# EAGLE design untitled (EAGLE 9.6.2)
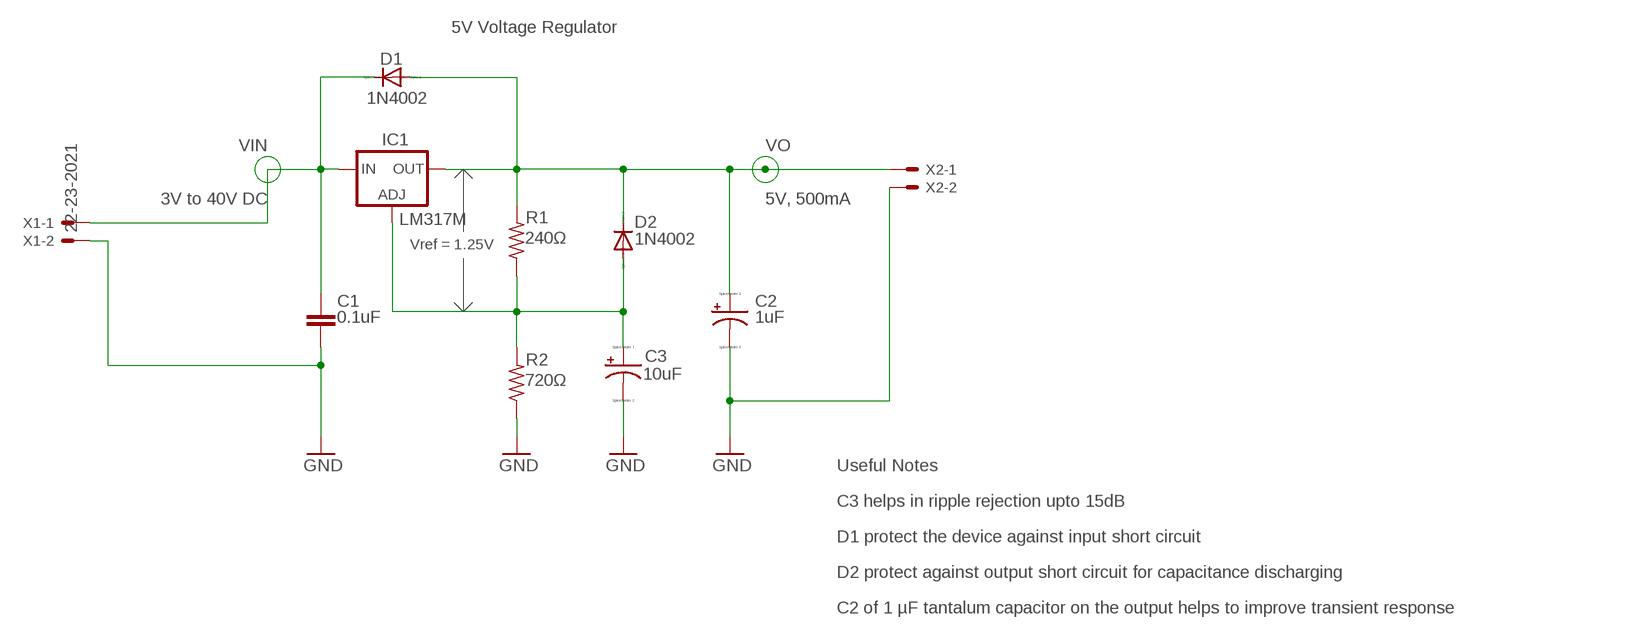
[diagram p0: schematic, sheet 1]

## Parts
C1  0.1uF  C-EU075-052X106  [C075-052X106]
C2  1uF  CPOL-US085CS-1AR  [085CS_1AR]
C3  10uF  CPOL-US085CS-1AR  [085CS_1AR]
D1  1N4002  1N4004  [DO41-10]
D2  1N4002  1N4004  [DO41-10]
IC1  LM317MBSTT3  [SOT223]
R1  240Ω  R-US_M0805  [M0805]
R2  720Ω  R-US_M0805  [M0805]
X1  22-23-2021  [22-23-2021]
X2  22-23-2021  [22-23-2021]

## Nets
GND: C1.2 C2.- C3.- R2.1 X1.2 X2.2
N$1: C3.+ D2.A IC1.1(ADJ) R1.1 R2.2
VIN: C1.1 D1.C IC1.3(IN) X1.1
VO: C2.+ D1.A D2.C IC1.4(OUT) R1.2 X2.1

## Notes on the sheet
- 5V Voltage Regulator
- 3V to 40V DC | 5V, 500mA
- Vref = 1.25V
- Useful Notes
- C3 helps in ripple rejection upto 15dB
- D1 protect the device against input short circuit
- D2 protect against output short circuit for capacitance discharging
- C2 of 1 µF tantalum capacitor on the output helps to improve transient response

## Library data of the parts
C1 = rcl:C-EU: CAPACITOR, European symbol
C2 C3 = resistor:CPOL-US: POLARIZED CAPACITOR, American symbol
D1 D2 = diode:1N4004: DIODE general purpose rectifier, 1 A
IC1 = v-reg:LM317?*: 500 mA Adjustable Output Positive Voltage Regulator Source: http://www.onsemi.co.jp .. LM317M-D.PDF; PARTNUMBER: LM317M
R1 R2 = resistor:R-US_: RESISTOR, American symbol
X1 X2 = con-molex:22-23-2021: .100" (2.54mm) Center Header - 2 Pin; MF: MOLEX; MPN: 22-23-2021; OC_FARNELL: 1462926; OC_NEWARK: 25C3832

## Board
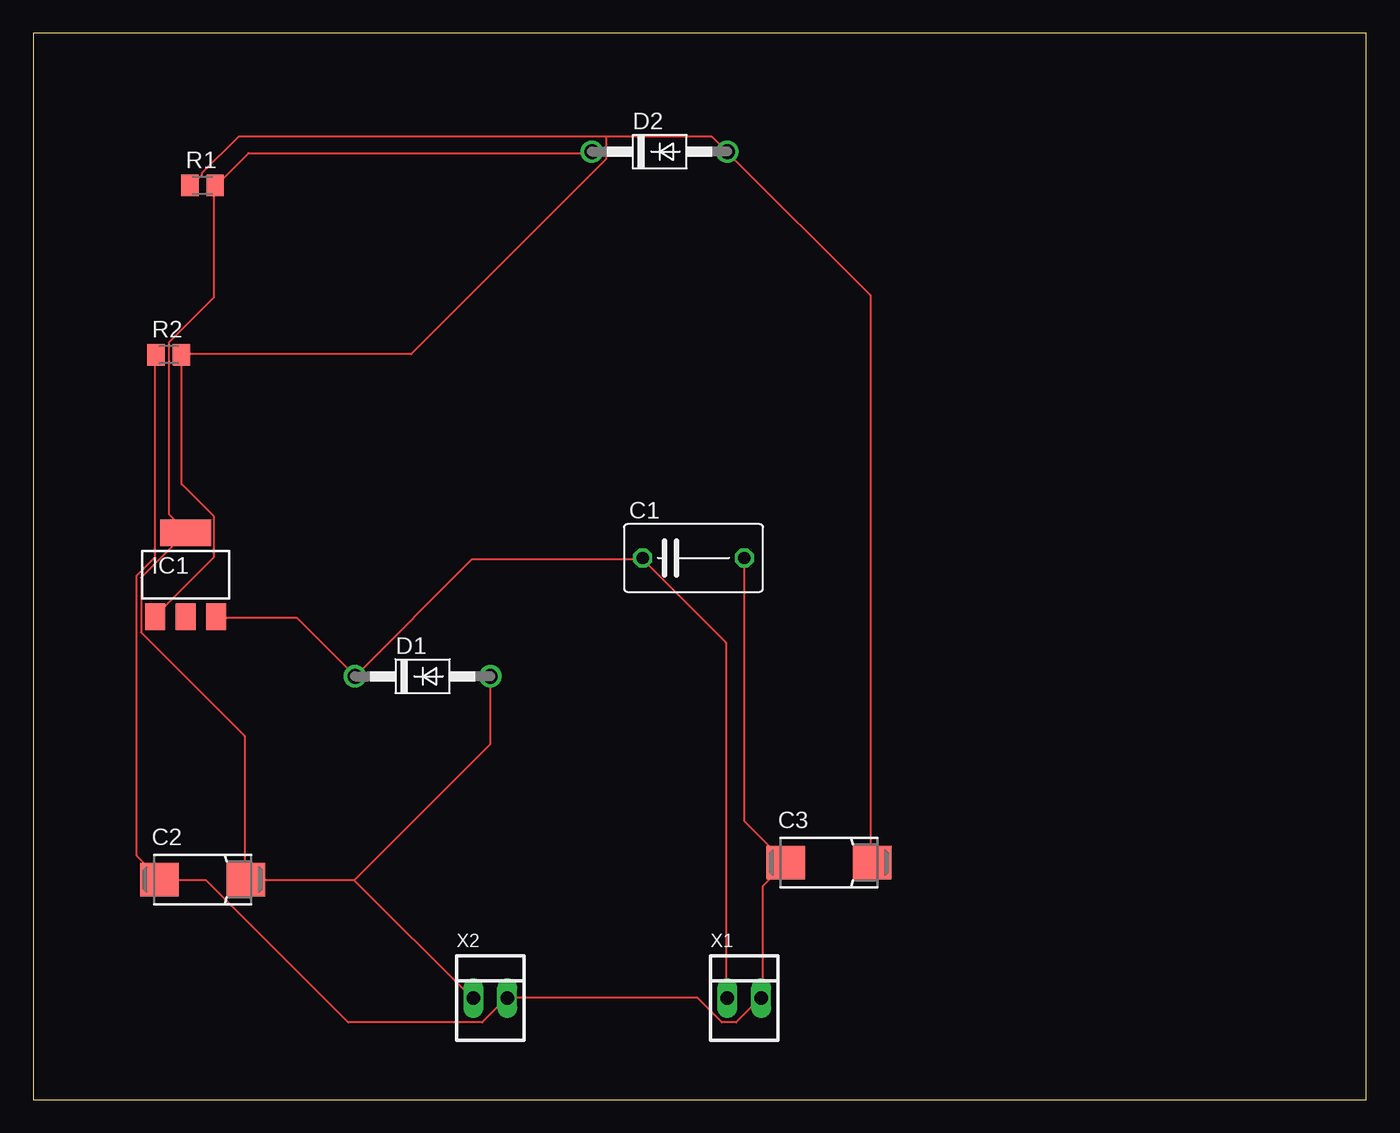
[diagram p1: board, top side]

Size 100 x 80 mm. Coordinates in mm from the lower left corner, seen from the top.
Outline: 0,0 100,0 100,80 0,80 0,0
Copper layers (1*16): Top 0.035mm / dielectric 1.5mm / Bottom 0.035mm
Design rules "default": minimum track width 6mil, minimum drill 0.35mm, track to track 6mil, track to pad 6mil, pad to pad 6mil, via to via 6mil, smd to smd 6mil, copper to edge 40mil, drill to drill 6mil, minimum pad ring 10mil, minimum via ring 8mil, stop-mask expansion 4mil, vias tented up to drill 0mil, thermal gap 10mil

### Footprints (pad centres in the part's own frame; a part is rotated, then mirrored left to right if it is on the bottom)
C075-052X106 = drill 0.914 octagon: 1 -3.81,0; 2 3.81,0
085CS_1AR = smd 2.9 x 2.5: + 3.25,0; - -3.25,0
DO41-10 = drill 1.118: A 5.08,0; C -5.08,0
SOT223 = smd 1.5 x 2: 1 -2.3,-3.15; 2 0,-3.15; 3 2.3,-3.15 | smd 3.8 x 2: 4 0,3.15
M0805 = smd 1.3 x 1.6: 1 -0.95,0; 2 0.95,0
22-23-2021 = drill 1 long: 1 -1.27,0; 2 1.27,0

### Placement (x,y rotation side)
C1  49.53,40.64 0 top
C2  12.7,16.51 0 top
C3  59.69,17.78 0 top
D1  29.21,31.75 0 top
D2  46.99,71.12 0 top
IC1  11.43,39.37 0 top
R1  12.7,68.58 0 top
R2  10.16,55.88 0 top
X1  53.34,7.62 0 top
X2  34.29,7.62 0 top

### Tracks (layer width: path | path; a pad name or v marks a point on that pad's centre or on a via)
GND
  Top 0.152: R2.1 9.14,55.78 9.14,40.69 7.77,39.32 7.77,18.29 9.45,16.61 C2.- 9.6,16.46 12.95,16.46 23.62,5.79 33.68,5.79 35.51,7.62 X2.2 49.84,7.62 51.66,5.79 52.73,5.79 54.56,7.62 X1.2 54.71,7.62 54.71,16 56.39,17.68 C3.- 56.39,17.83 53.34,20.88 C1.2
N$1
  Top 0.152: IC1.1 9.14,36.27 13.56,40.69 13.56,43.74 11.12,46.18 11.12,55.78 R2.2 11.12,55.93 28.35,55.93 42.98,70.56 42.98,72.24 | 42.98,72.24 50.9,72.24 51.97,71.17 D2.A 52.12,71.02 62.79,60.35 62.79,17.83 C3.+ | 42.98,72.24 15.39,72.24 12.65,69.49 12.65,69.34 11.89,68.58 R1.1
VIN
  Top 0.152: IC1.3 13.87,36.12 19.81,36.12 24.08,31.85 D1.C 32.92,40.54 45.72,40.54 | 45.72,40.54 51.97,34.29 51.97,7.62 X1.1 | 45.72,40.54 C1.1
VO
  Top 0.152: 24.08,16.46 16,16.46 C2.+ 15.85,16.61 15.85,27.28 8.08,35.05 8.08,39.17 IC1.4 | 24.08,16.46 32.92,7.62 X2.1 | D1.A 34.29,26.67 24.08,16.46 | IC1.4 11.43,42.67 10.21,43.89 10.21,56.84 13.56,60.2 13.56,68.58 R1.2 13.72,68.58 16.15,71.02 41.91,71.02 D2.C | IC1.4